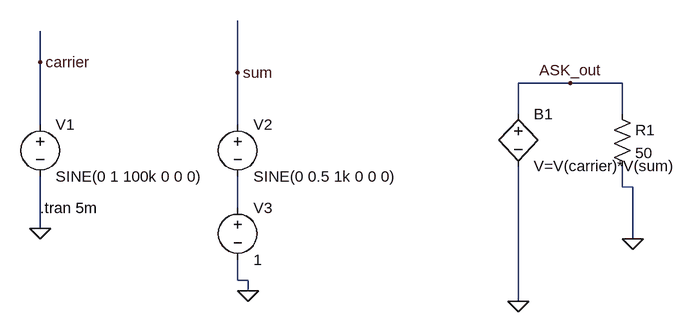
[diagram p0: schematic AM.asc]
AM.asc, the LTspice schematic file:
Version 4.1
SHEET 1 976 680
WIRE -32 16 -32 -32
WIRE 272 32 272 -48
WIRE 784 48 704 48
WIRE 864 48 784 48
WIRE 704 96 704 48
WIRE 864 96 864 48
WIRE -32 112 -32 16
WIRE 272 112 272 32
WIRE 864 208 864 176
WIRE 880 208 864 208
WIRE 272 240 272 192
WIRE -32 272 -32 192
WIRE 880 288 880 208
WIRE 272 352 272 320
WIRE 288 352 272 352
WIRE 288 368 288 352
WIRE 704 384 704 176
FLAG -32 272 0
FLAG 288 368 0
FLAG -32 16 carrier
FLAG 272 32 sum
FLAG 704 384 0
FLAG 880 288 0
FLAG 784 48 ASK_out
SYMBOL voltage -32 96 R0
WINDOW 123 0 0 Left 0
WINDOW 39 0 0 Left 0
SYMATTR InstName V1
SYMATTR Value SINE(0 1 100k 0 0 0)
SYMBOL voltage 272 96 R0
WINDOW 123 0 0 Left 0
WINDOW 39 0 0 Left 0
SYMATTR InstName V2
SYMATTR Value SINE(0 0.5 1k 0 0 0)
SYMBOL bv 704 80 R0
SYMATTR InstName B1
SYMATTR Value V=V(carrier)*V(sum)
SYMBOL res 848 80 R0
SYMATTR InstName R1
SYMATTR Value 50
SYMBOL voltage 272 224 R0
SYMATTR InstName V3
SYMATTR Value 1
TEXT -32 240 Left 2 !.tran 5m

The netlist it stands for:
* AM.asc
V1 carrier 0 SINE(0 1 100k 0 0 0)
V2 sum N001 SINE(0 0.5 1k 0 0 0)
B1 ASK_out 0 V=V(carrier)*V(sum)
R1 ASK_out 0 50
V3 N001 0 1
.tran 5m
.backanno
.end